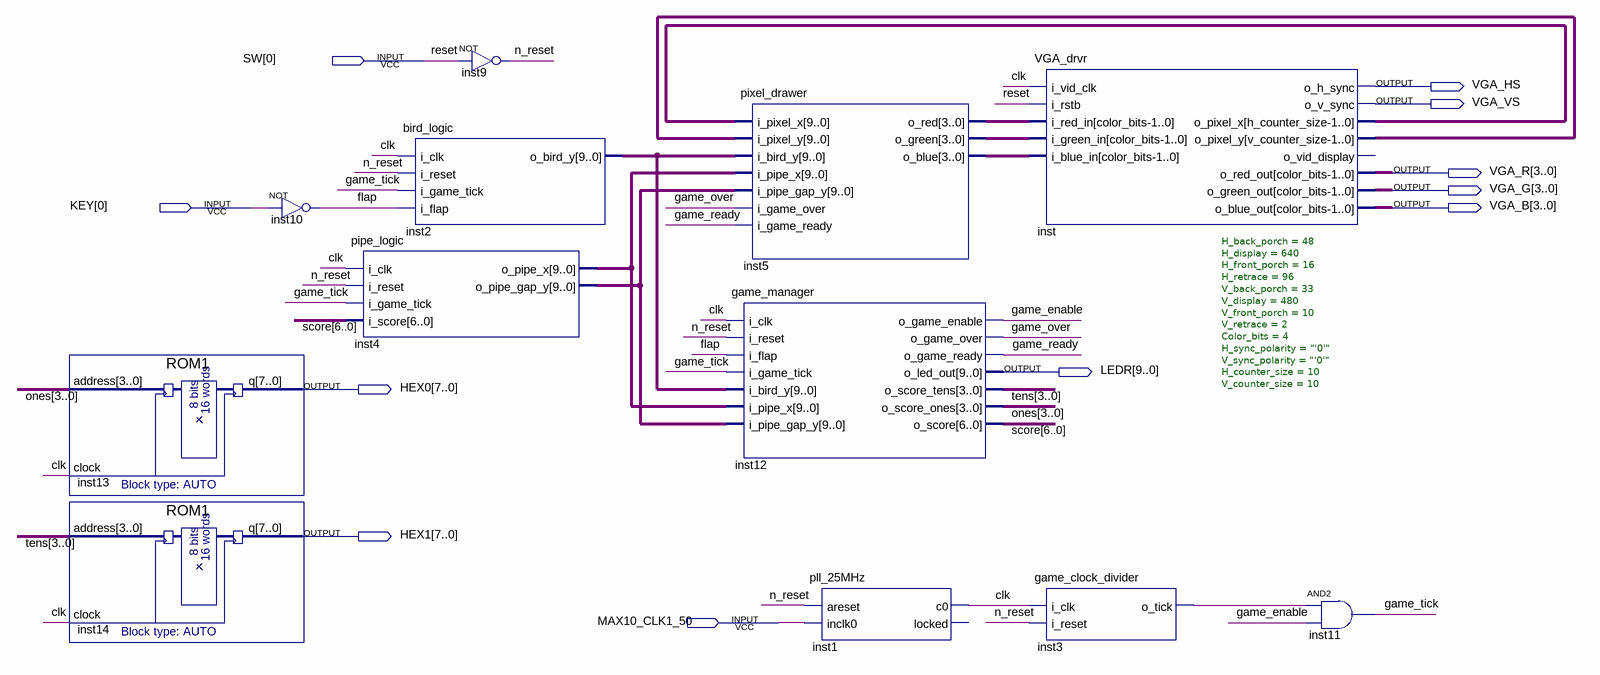
[diagram p0: schematic sheet]
// Quartus schematic FPGA_Bird.bdf as structural Verilog: 12 symbols, 11 pins
module FPGA_Bird (
  input  [0:0] SW,
  input  [0:0] KEY,
  input  MAX10_CLK1_50,
  output VGA_HS,
  output VGA_VS,
  output [3:0] VGA_R,
  output [3:0] VGA_G,
  output [3:0] VGA_B,
  output [9:0] LEDR,
  output [7:0] HEX0,
  output [7:0] HEX1
);

  wire clk, flap, game_enable, game_over, game_ready, game_tick, inst3_o_tick, n_reset;
  wire [3:0] inst5_o_blue, inst5_o_green, inst5_o_red, ones, tens;
  wire [6:0] score;
  wire [9:0] inst2_o_bird_y, inst4_o_pipe_gap_y, inst4_o_pipe_x, inst_o_pixel_x, inst_o_pixel_y;

  ROM1 inst13 (.address(ones), .clock(clk), .q(HEX0));
  ROM1 inst14 (.address(tens), .clock(clk), .q(HEX1));
  not inst10 (flap, KEY[0]);
  pipe_logic inst4 (
    .i_clk(clk), .i_reset(n_reset), .i_game_tick(game_tick), .i_score(score), .o_pipe_x(inst4_o_pipe_x),
    .o_pipe_gap_y(inst4_o_pipe_gap_y));
  bird_logic inst2 (.i_clk(clk), .i_reset(n_reset), .i_game_tick(game_tick), .i_flap(flap), .o_bird_y(inst2_o_bird_y));
  not inst9 (n_reset, SW[0]);
  pixel_drawer inst5 (
    .i_pixel_x(inst_o_pixel_x), .i_pixel_y(inst_o_pixel_y), .i_bird_y(inst2_o_bird_y),
    .i_pipe_x(inst4_o_pipe_x), .i_pipe_gap_y(inst4_o_pipe_gap_y), .i_game_over(game_over),
    .i_game_ready(game_ready), .o_red(inst5_o_red), .o_green(inst5_o_green), .o_blue(inst5_o_blue));
  game_manager inst12 (
    .i_clk(clk), .i_reset(n_reset), .i_flap(flap), .i_game_tick(game_tick), .i_bird_y(inst2_o_bird_y),
    .i_pipe_x(inst4_o_pipe_x), .i_pipe_gap_y(inst4_o_pipe_gap_y), .o_game_enable(game_enable),
    .o_game_over(game_over), .o_game_ready(game_ready), .o_led_out(LEDR), .o_score_tens(tens),
    .o_score_ones(ones), .o_score(score));
  pll_25MHz inst1 (.areset(n_reset), .inclk0(MAX10_CLK1_50), .c0(clk));  // open: locked
  VGA_drvr #(.H_back_porch(48), .H_display(640), .H_front_porch(16), .H_retrace(96), .V_back_porch(33), .V_display(480), .V_front_porch(10), .V_retrace(2), .Color_bits(4), .H_sync_polarity("'0'"), .V_sync_polarity("'0'"), .H_counter_size(10), .V_counter_size(10)) inst (
    .i_vid_clk(clk), .i_rstb(SW[0]), .i_red_in(inst5_o_red), .i_green_in(inst5_o_green),
    .i_blue_in(inst5_o_blue), .o_h_sync(VGA_HS), .o_v_sync(VGA_VS), .o_pixel_x(inst_o_pixel_x),
    .o_pixel_y(inst_o_pixel_y), .o_red_out(VGA_R), .o_green_out(VGA_G), .o_blue_out(VGA_B));  // open: o_vid_display
  game_clock_divider inst3 (.i_clk(clk), .i_reset(n_reset), .o_tick(inst3_o_tick));
  and inst11 (game_tick, inst3_o_tick, game_enable);

  // Other names for the same wires on the sheet: reset = SW[0]
endmodule
